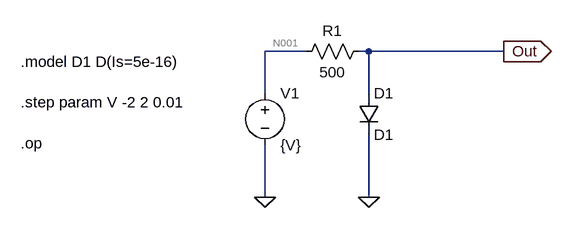
[diagram p0: schematic schematic.asc]
schematic.asc, the LTspice schematic file:
Version 4.1
SHEET 1 880 680
WIRE 64 64 0 64
WIRE 160 64 144 64
WIRE 368 64 160 64
WIRE 0 128 0 64
WIRE 160 128 160 64
WIRE 0 288 0 208
WIRE 160 288 160 192
FLAG 0 288 0
FLAG 160 288 0
FLAG 368 64 Out
IOPIN 368 64 Out
SYMBOL diode 144 128 R0
SYMATTR InstName D1
SYMATTR Value D1
SYMBOL voltage 0 112 R0
SYMATTR InstName V1
SYMATTR Value {V}
SYMBOL res 160 48 R90
WINDOW 0 0 56 VBottom 2
WINDOW 3 32 56 VTop 2
SYMATTR InstName R1
SYMATTR Value 500
TEXT -376 80 Left 2 !.model D1 D(Is=5e-16)\n \n.step param V -2 2 0.01\n \n.op

The netlist it stands for:
* schematic.asc
D1 Out 0 D1
V1 N001 0 {V}
R1 Out N001 500
.model D D
.lib standard.dio
.model D1 D(Is=5e-16)
.step param V -2 2 0.01
.op
.backanno
.end

* Results of the author's LTspice run, read from the files saved beside the schematic
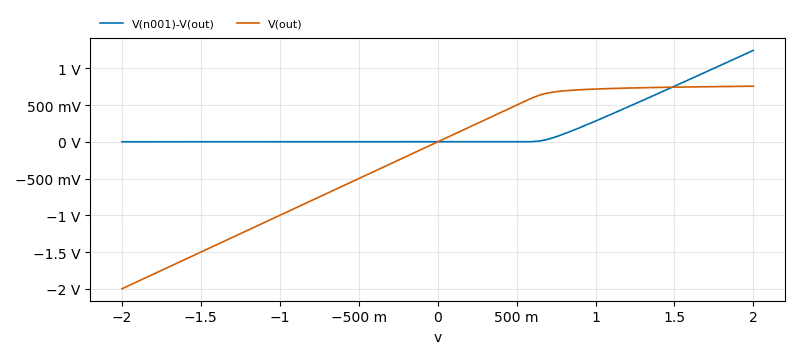
[diagram p1: Operating Point of schematic.asc, plotted from the saved traces]
* Operating Point, 1 run:
*   V(n001)-V(out): 0 V at v=-2 , 1.244 V at v=2 , min 0 V, max 1.244 V
*   V(out): -2 V at v=-2 , 756.2 mV at v=2 , min -2 V, max 756.2 mV